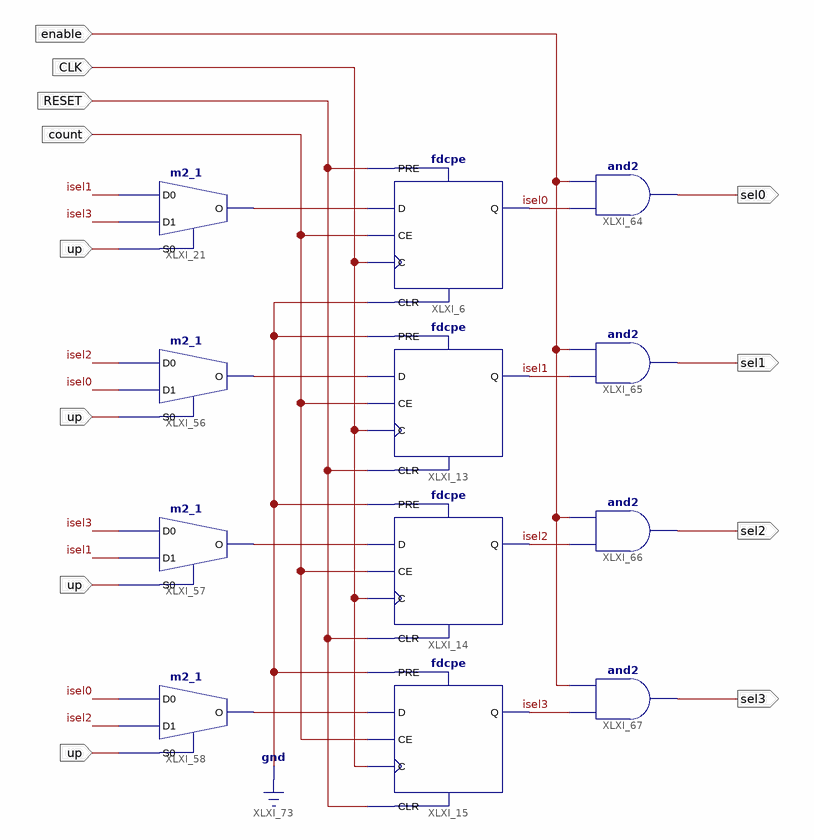
[diagram p0: schematic sheet 1]
// Xilinx ISE schematic shift4.sch (spartan3e) as structural Verilog: 12 symbols, 9 ports
module shift4 (
  input  RESET,
  input  CLK,
  input  count,
  input  up,
  input  enable,
  output sel0,
  output sel1,
  output sel2,
  output sel3
);

  wire isel0, isel1, isel2, isel3, XLXN_76, XLXN_77, XLXN_78, XLXN_79;

  fdcpe XLXI_6 (.C(CLK), .CE(count), .CLR(1'b0), .D(XLXN_76), .PRE(RESET), .Q(isel0));
  fdcpe XLXI_13 (.C(CLK), .CE(count), .CLR(RESET), .D(XLXN_77), .PRE(1'b0), .Q(isel1));
  fdcpe XLXI_14 (.C(CLK), .CE(count), .CLR(RESET), .D(XLXN_78), .PRE(1'b0), .Q(isel2));
  fdcpe XLXI_15 (.C(CLK), .CE(count), .CLR(RESET), .D(XLXN_79), .PRE(1'b0), .Q(isel3));
  m2_1 XLXI_56 (.D0(isel2), .D1(isel0), .S0(up), .O(XLXN_77));
  m2_1 XLXI_57 (.D0(isel3), .D1(isel1), .S0(up), .O(XLXN_78));
  m2_1 XLXI_58 (.D0(isel0), .D1(isel2), .S0(up), .O(XLXN_79));
  m2_1 XLXI_21 (.D0(isel1), .D1(isel3), .S0(up), .O(XLXN_76));
  and XLXI_64 (sel0, isel0, enable);
  and XLXI_65 (sel1, isel1, enable);
  and XLXI_66 (sel2, isel2, enable);
  and XLXI_67 (sel3, isel3, enable);
endmodule
